# Altium schematic sheet Sheet2.SchDoc
size A4
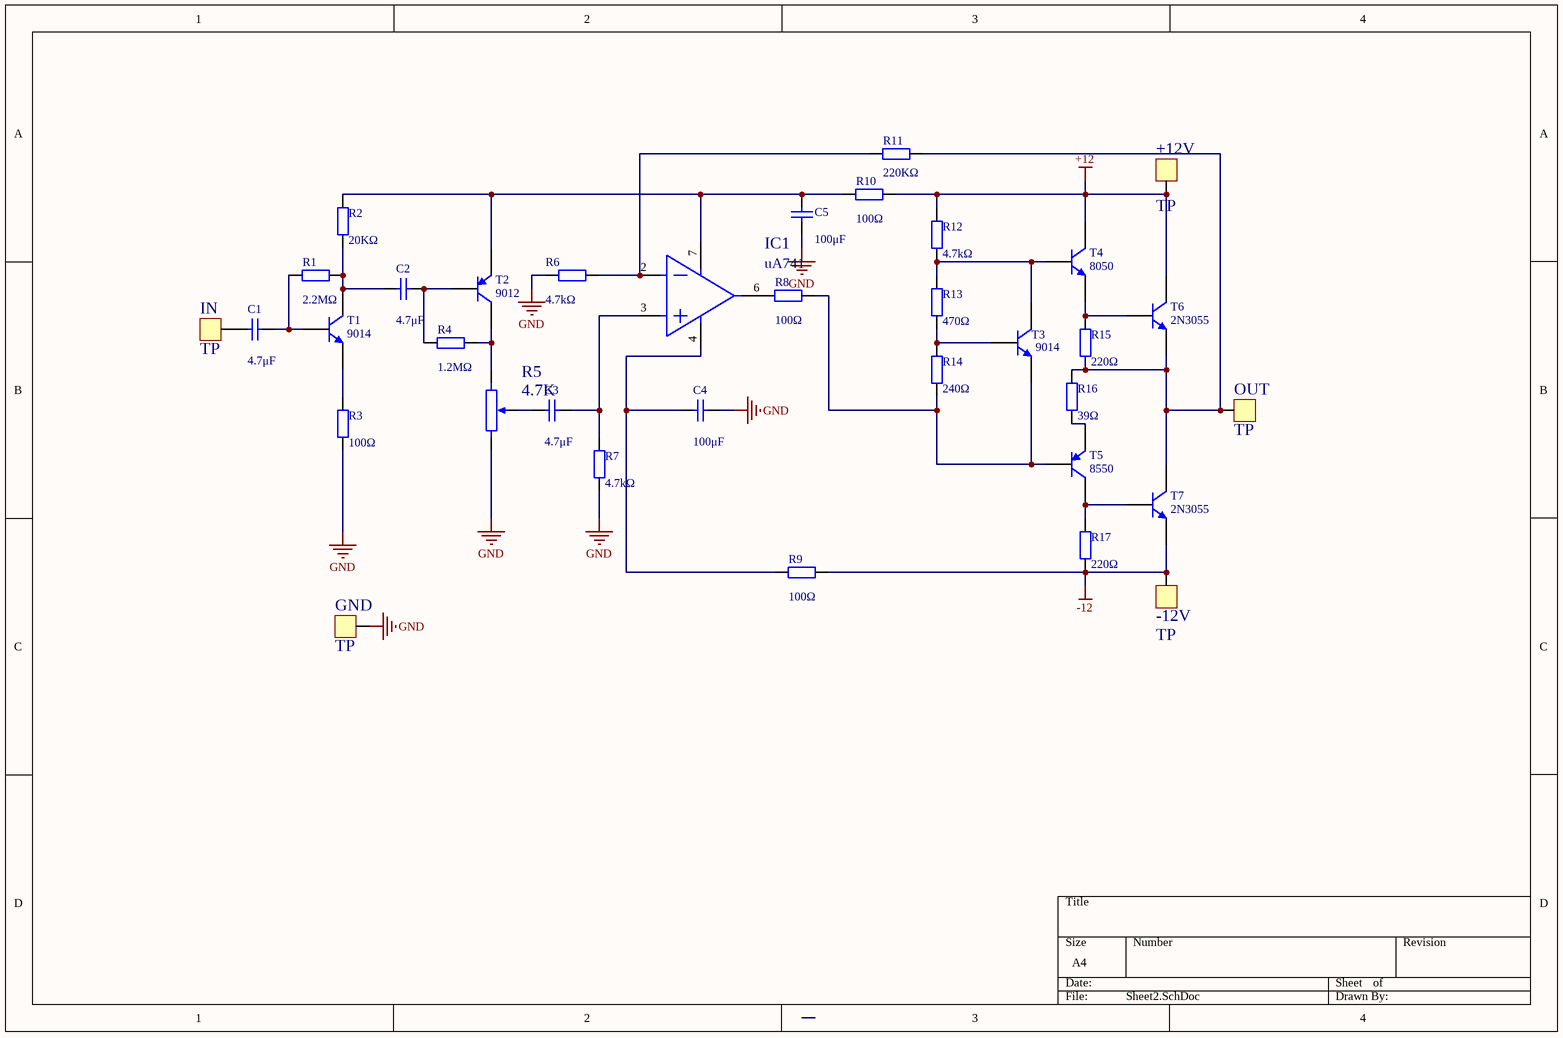
[diagram p0: Sheet2.SchDoc]

## Parts
+12V  TP  [TP2]
-12V  TP  [TP2]
C1  value 4.7μF  [CAPPR5-5x5]
C2  value 4.7μF  [CAPPR5-5x5]
C3  value 4.7μF  [CAPPR5-5x5]
C4  value 100μF  [CAPPR5-5x5]
C5  value 100μF  [CAPPR5-5x5]
GND  TP  [TP2]
IC1  uA741  [DIP-8]
IN  TP  [TP2]
OUT  TP  [TP2]
R1  value 2.2MΩ  [AXIAL-0.4]
R2  value 20KΩ  [AXIAL-0.4]
R3  value 100Ω  [AXIAL-0.4]
R4  value 1.2MΩ  [AXIAL-0.4]
R5  value 4.7K  [RPOT]  (hidden comment: RPOT)
R6  value 4.7kΩ  [AXIAL-0.4]
R7  value 4.7kΩ  [AXIAL-0.4]
R8  value 100Ω  [AXIAL-0.4]
R9  value 100Ω  [AXIAL-0.4]
R10  value 100Ω  [AXIAL-0.4]
R11  value 220KΩ  [AXIAL-0.4]
R12  value 4.7kΩ  [AXIAL-0.4]
R13  value 470Ω  [AXIAL-0.4]
R14  value 240Ω  [AXIAL-0.4]
R15  value 220Ω  [AXIAL-0.4]
R16  value 39Ω  [AXIAL-0.4]
R17  value 220Ω  [AXIAL-0.4]
T1  9014  [TANS]
T2  9012  [TANS]
T3  9014  [TANS]
T4  8050  [TANS]
T5  8550  [TANS]
T6  2N3055  [TO-3]
T7  2N3055  [TO-3]

## Nets
1: IC1.1
8: IC1.8
+12: +12V.1 R10.2 R12.2 T4.3(C) T6.3(C)
-12: -12V.1 R9.2 R17.1 T7.1(E)
GND: C4.1 C5.1 GND.1 R3.1 R5.3(BOT) R6.1 R7.1
NetC1_1: C1.1 IN.1
NetC1_2: C1.2 R1.1 T1.2(B)
NetC2_1: C2.1 R1.2 R2.1 T1.3(C)
NetC2_2: C2.2 R4.1 T2.2(B)
NetC3_1: C3.1 R5.2(TAP)
NetC3_2: C3.2 IC1.3 R7.2
NetC4_2: C4.2 IC1.4 R9.1
NetC5_2: C5.2 IC1.7 R2.2 R10.1 T2.1(E)
NetIC1_2: IC1.2 R6.2 R11.1
NetIC1_6: IC1.6 R8.1
NetOUT_1: OUT.1 R11.2 R15.2 R16.2 T6.1(E) T7.3(C)
NetR3_2: R3.2 T1.1(E)
NetR4_2: R4.2 R5.1(TOP) T2.3(C)
NetR8_2: R8.2 R14.1 T3.1(E) T5.2(B)
NetR12_1: R12.1 R13.2 T3.3(C) T4.2(B)
NetR13_1: R13.1 R14.2 T3.2(B)
NetR15_1: R15.1 T4.1(E) T6.2(B)
NetR16_1: R16.1 T5.1(E)
NetR17_2: R17.2 T5.3(C) T7.2(B)

## Library data of the parts
C1-C5 = Cap: Capacitor; Published: 8-Jun-2000; LatestRevisionDate: 17-Jul-2002; LatestRevisionNote: Re-released for DXP Platform.; PackageReference: RAD-0.3; Publisher: Altium Limited; PackageDescription: Radial Cap, Thru-Hole; 2 Leads; 0.3 in Pin Spacing
IC1 = uA741: OAP
R1-R4 R6-R17 = Res2: Resistor; Published: 8-Jun-2000; LatestRevisionDate: 17-Jul-2002; LatestRevisionNote: Re-released for DXP Platform.; PackageReference: AXIAL-0.4; Publisher: Altium Limited; PackageDescription: Axial Device, Thru-Hole; 2 Leads; 0.4 in Pin Spacing
R5 = RPOT: Potentiometer
T1 T3 T4 T6 T7 = 2N3904: NPN General Purpose Amplifier; Published: 8-Jun-2000; LatestRevisionDate: 15-Jan-2003; LatestRevisionNote: PCB Footprint 'BCY-W3/D4.7' replaced; DatasheetVersion: 1997; PackageVersion: Sep-1998; PackageReference: TO-92A; Publisher: Altium Limited; PackageDescription: TO, Flat Index; 3 In-Line, Axial Leads; Body Dia. 4.5mm; Leads 0.51 x 0.48 mm (max); ComponentLink1Description: Manufacturer Link; ComponentLink1URL: http://www.fairchildsemi.com/; ComponentLink2Description: Datasheet; ComponentLink2URL: http://www.fairchildsemi.com/ds/2N%2F2N3904.pdf
T2 T5 = 2N3906: PNP General Purpose Amplifier; Published: 8-Jun-2000; LatestRevisionDate: 15-Jan-2003; LatestRevisionNote: PCB Footprint 'BCY-W3/D4.7' replaced; DatasheetVersion: 1997; PackageVersion: Sep-1998; PackageReference: TO-92A; Publisher: Altium Limited; PackageDescription: TO, Flat Index; 3 In-Line, Axial Leads; Body Dia. 4.5mm; Leads 0.51 x 0.48 mm (max); ComponentLink1Description: Manufacturer Link; ComponentLink1URL: http://www.fairchildsemi.com/; ComponentLink2Description: Datasheet; ComponentLink2URL: http://www.fairchildsemi.com/ds/2N%2F2N3906.pdf